# EAGLE design NUCLEO_UNIVERSAL_BOARD (EAGLE 9.6.2)
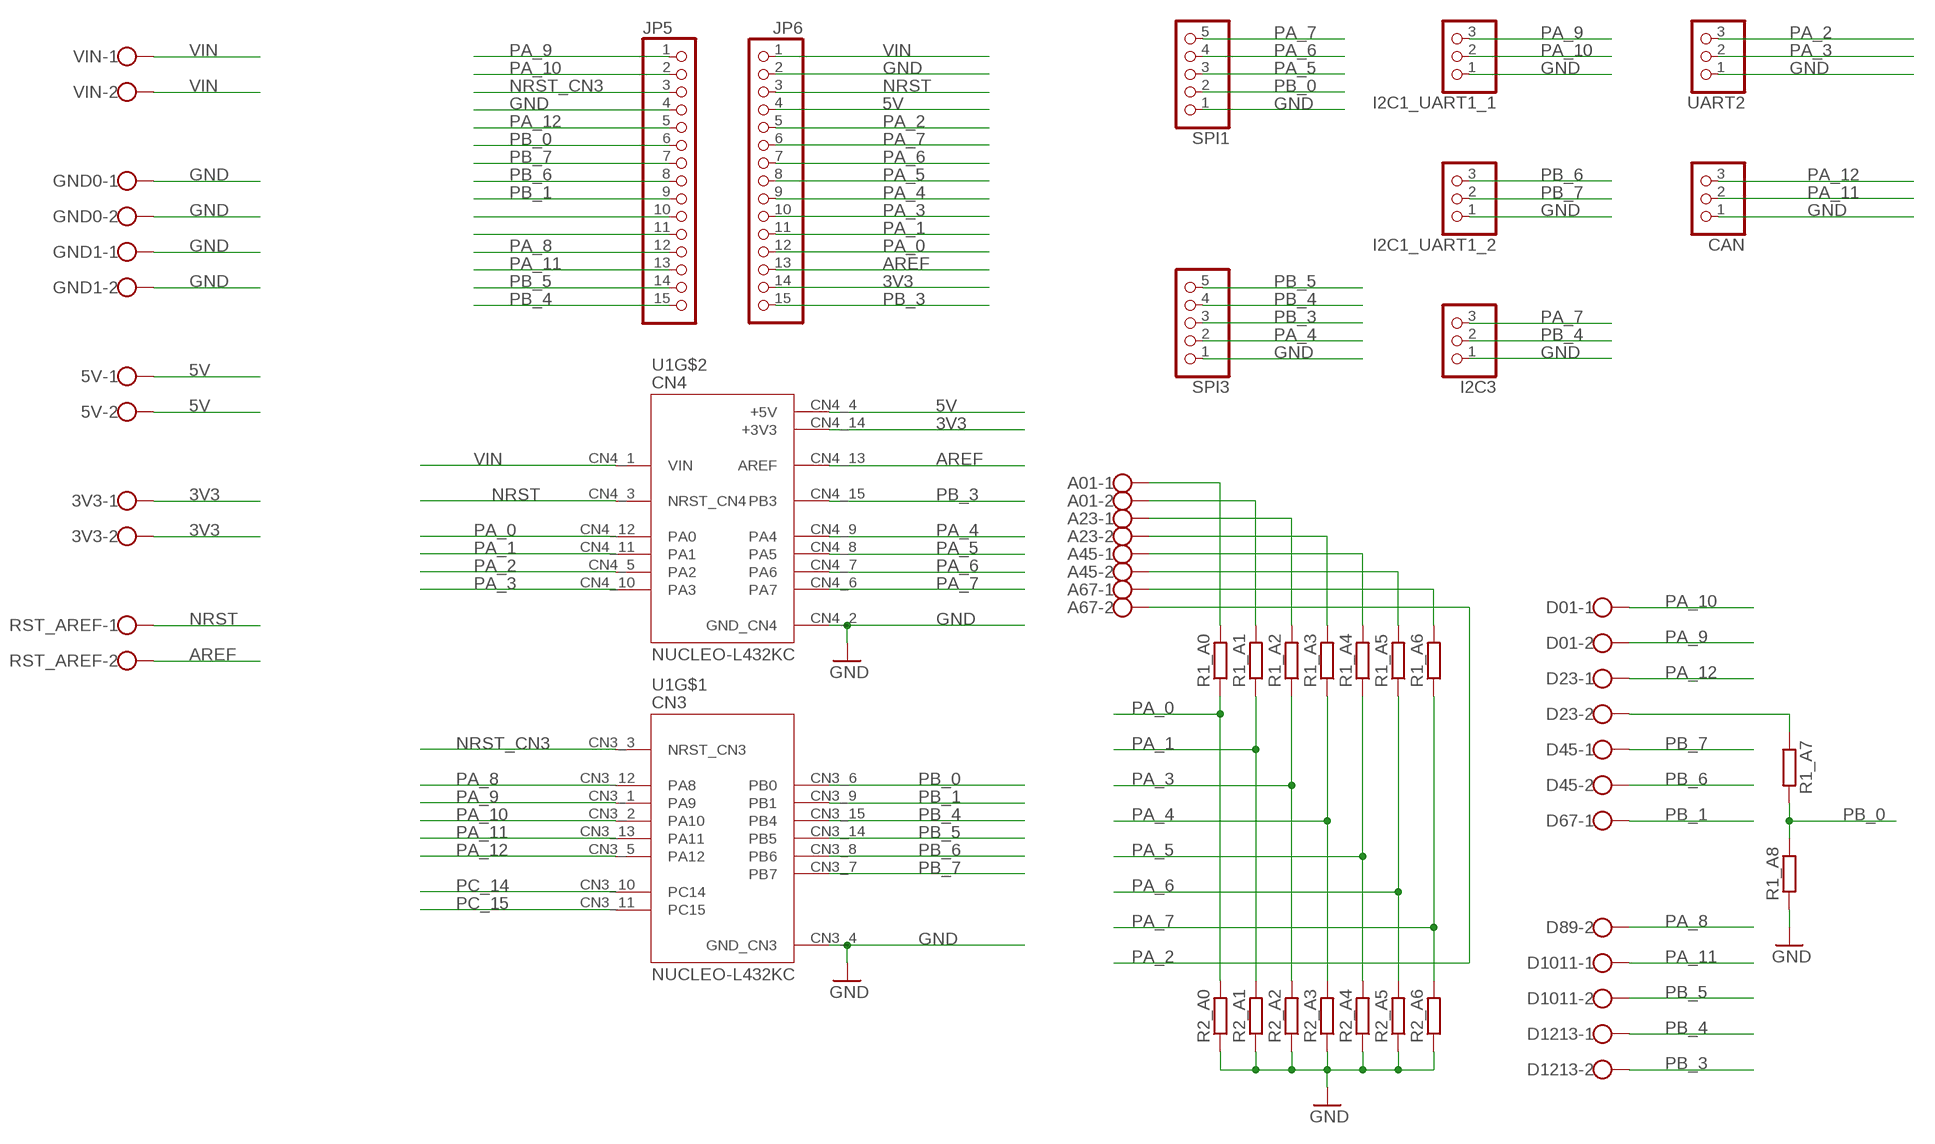
[diagram p0: schematic, sheet 1]

## Parts
3V3  W237-102  [W237-102]
5V  W237-102  [W237-102]
A01  W237-102  [W237-102]
A23  W237-102  [W237-102]
A45  W237-102  [W237-102]
A67  W237-102  [W237-102]
CAN  PINHD-1X3  [1X03]
D01  W237-102  [W237-102]
D23  W237-102  [W237-102]
D45  W237-102  [W237-102]
D67  W237-102  [W237-102]
D89  W237-102  [W237-102]
D1011  W237-102  [W237-102]
D1213  W237-102  [W237-102]
GND0  W237-102  [W237-102]
GND1  W237-102  [W237-102]
I2C1_UART1_1  PINHD-1X3  [1X03]
I2C1_UART1_2  PINHD-1X3  [1X03]
I2C3  PINHD-1X3  [1X03]
JP5  PINHD-1X15  [1X15]
JP6  PINHD-1X15  [1X15]
R1_A0  R-EU_M1206  [M1206]
R1_A1  R-EU_M1206  [M1206]
R1_A2  R-EU_M1206  [M1206]
R1_A3  R-EU_M1206  [M1206]
R1_A4  R-EU_M1206  [M1206]
R1_A5  R-EU_M1206  [M1206]
R1_A6  R-EU_M1206  [M1206]
R1_A7  R-EU_M1206  [M1206]
R1_A8  R-EU_M1206  [M1206]
R2_A0  R-EU_M1206  [M1206]
R2_A1  R-EU_M1206  [M1206]
R2_A2  R-EU_M1206  [M1206]
R2_A3  R-EU_M1206  [M1206]
R2_A4  R-EU_M1206  [M1206]
R2_A5  R-EU_M1206  [M1206]
R2_A6  R-EU_M1206  [M1206]
RST_AREF  W237-102  [W237-102]
SPI1  PINHD-1X5  [1X05]
SPI3  PINHD-1X5  [1X05]
U1  NUCLEO-L432KC  [MODULE_NUCLEO-L432KC]
UART2  PINHD-1X3  [1X03]
VIN  W237-102  [W237-102]

## Nets
3V3: 3V3.1 3V3.2 JP6.14 U1.CN4_14(+3V3)
5V: 5V.1 5V.2 JP6.4 U1.CN4_4(+5V)
AREF: JP6.13 RST_AREF.2 U1.CN4_13(AREF)
GND: CAN.1 GND0.1 GND0.2 GND1.1 GND1.2 I2C1_UART1_1.1 I2C1_UART1_2.1 I2C3.1 JP5.4 JP6.2 R1_A8.1 R2_A0.1 R2_A1.1 R2_A2.1 R2_A3.1 R2_A4.1 R2_A5.1 R2_A6.1 SPI1.1 SPI3.1 U1.CN3_4(GND_CN3) U1.CN4_2(GND_CN4) UART2.1
N$1: D23.2 R1_A7.1
N$11: A67.1 R1_A6.2
N$12: A45.2 R1_A5.2
N$29: JP5.10
N$30: JP5.11
N$31: A45.1 R1_A4.2
N$32: A23.2 R1_A3.2
N$33: A23.1 R1_A2.2
N$34: A01.2 R1_A1.2
N$35: A01.1 R1_A0.2
NRST: JP6.3 RST_AREF.1 U1.CN4_3(NRST_CN4)
NRST_CN3: JP5.3 U1.CN3_3(NRST_CN3)
PA_0: JP6.12 R1_A0.1 R2_A0.2 U1.CN4_12(PA0)
PA_1: JP6.11 R1_A1.1 R2_A1.2 U1.CN4_11(PA1)
PA_2: A67.2 JP6.5 U1.CN4_5(PA2) UART2.3
PA_3: JP6.10 R1_A2.1 R2_A2.2 U1.CN4_10(PA3) UART2.2
PA_4: JP6.9 R1_A3.1 R2_A3.2 SPI3.2 U1.CN4_9(PA4)
PA_5: JP6.8 R1_A4.1 R2_A4.2 SPI1.3 U1.CN4_8(PA5)
PA_6: JP6.7 R1_A5.1 R2_A5.2 SPI1.4 U1.CN4_7(PA6)
PA_7: I2C3.3 JP6.6 R1_A6.1 R2_A6.2 SPI1.5 U1.CN4_6(PA7)
PA_8: D89.2 JP5.12 U1.CN3_12(PA8)
PA_9: D01.2 I2C1_UART1_1.3 JP5.1 U1.CN3_1(PA9)
PA_10: D01.1 I2C1_UART1_1.2 JP5.2 U1.CN3_2(PA10)
PA_11: CAN.2 D1011.1 JP5.13 U1.CN3_13(PA11)
PA_12: CAN.3 D23.1 JP5.5 U1.CN3_5(PA12)
PB_0: JP5.6 R1_A7.2 R1_A8.2 SPI1.2 U1.CN3_6(PB0)
PB_1: D67.1 JP5.9 U1.CN3_9(PB1)
PB_3: D1213.2 JP6.15 SPI3.3 U1.CN4_15(PB3)
PB_4: D1213.1 I2C3.2 JP5.15 SPI3.4 U1.CN3_15(PB4)
PB_5: D1011.2 JP5.14 SPI3.5 U1.CN3_14(PB5)
PB_6: D45.2 I2C1_UART1_2.3 JP5.8 U1.CN3_8(PB6)
PB_7: D45.1 I2C1_UART1_2.2 JP5.7 U1.CN3_7(PB7)
PC_14: U1.CN3_10(PC14)
PC_15: U1.CN3_11(PC15)
VIN: JP6.1 U1.CN4_1(VIN) VIN.1 VIN.2
Unconnected: D67.2 D89.1

## Library data of the parts
3V3 5V A01 A23 A45 A67 D01 D23 D45 D67 D89 D1011 D1213 GND0 GND1 RST_AREF VIN = con-wago-500:W237-102: WAGO SCREW CLAMP; MPN: 237-102; OC_FARNELL: unknown; OC_NEWARK: 70K9898
CAN I2C1_UART1_1 I2C1_UART1_2 I2C3 UART2 = pinhead:PINHD-1X3: PIN HEADER
JP5 JP6 = pinhead:PINHD-1X15: PIN HEADER
R1_A0 R1_A1-R1_A8 R2_A0 R2_A1-R2_A6 = rcl:R-EU_: RESISTOR, European symbol; SPICEPREFIX: R
SPI1 SPI3 = pinhead:PINHD-1X5: PIN HEADER
U1 = NUCLEO-L432KC:NUCLEO-L432KC: STM32 Nucleo-32 development board with STM32L432KC MCU, supports Arduino connectivity Check prices <https://pricing.snapeda.com/parts/NUCLEO-L432KC/STMicroelectronics/view-part?ref=eda>; AVAILABILITY: Warning; DESCRIPTION: STM32L432KC, mbed-Enabled Development Nucleo-32 STM32L4 ARM® Cortex®-M4 MCU 32-Bit Embedded Evaluation Board; MF: STMicroelectronics; MP: NUCLEO-L432KC; PACKAGE: None; PRICE: None; PURCHASE-URL: https://pricing.snapeda.com/search/part/NUCLEO-L432KC/?ref=eda

## Board
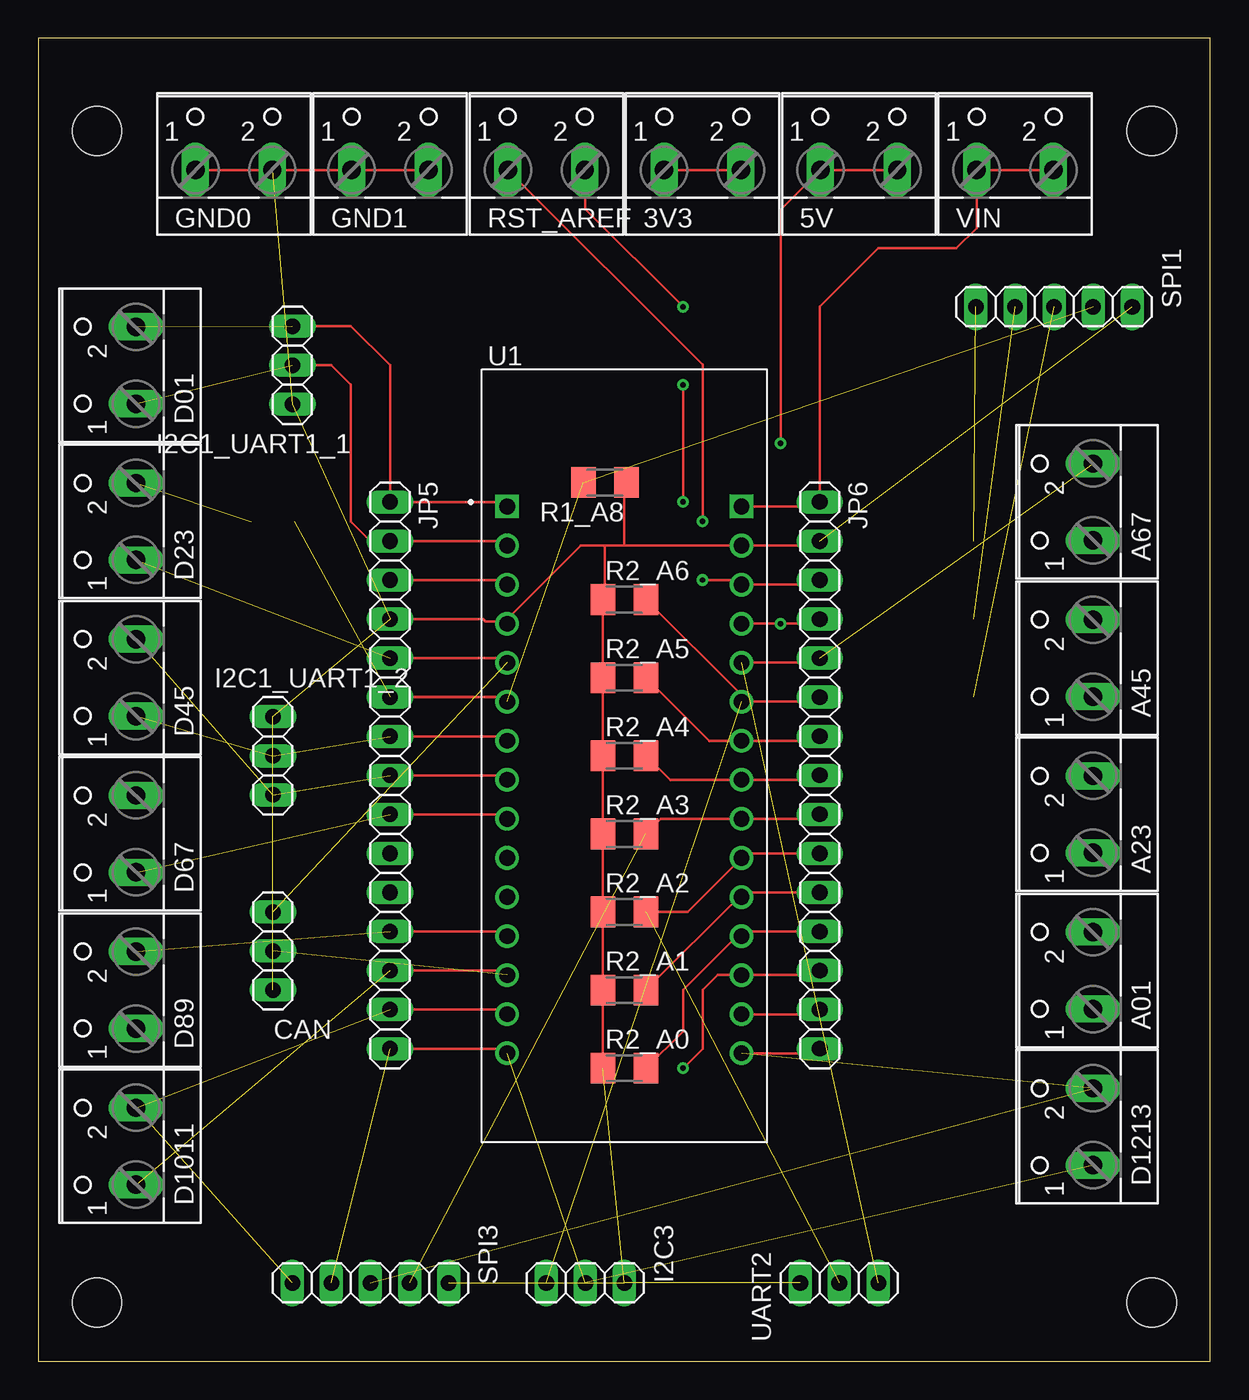
[diagram p1: board, top side]
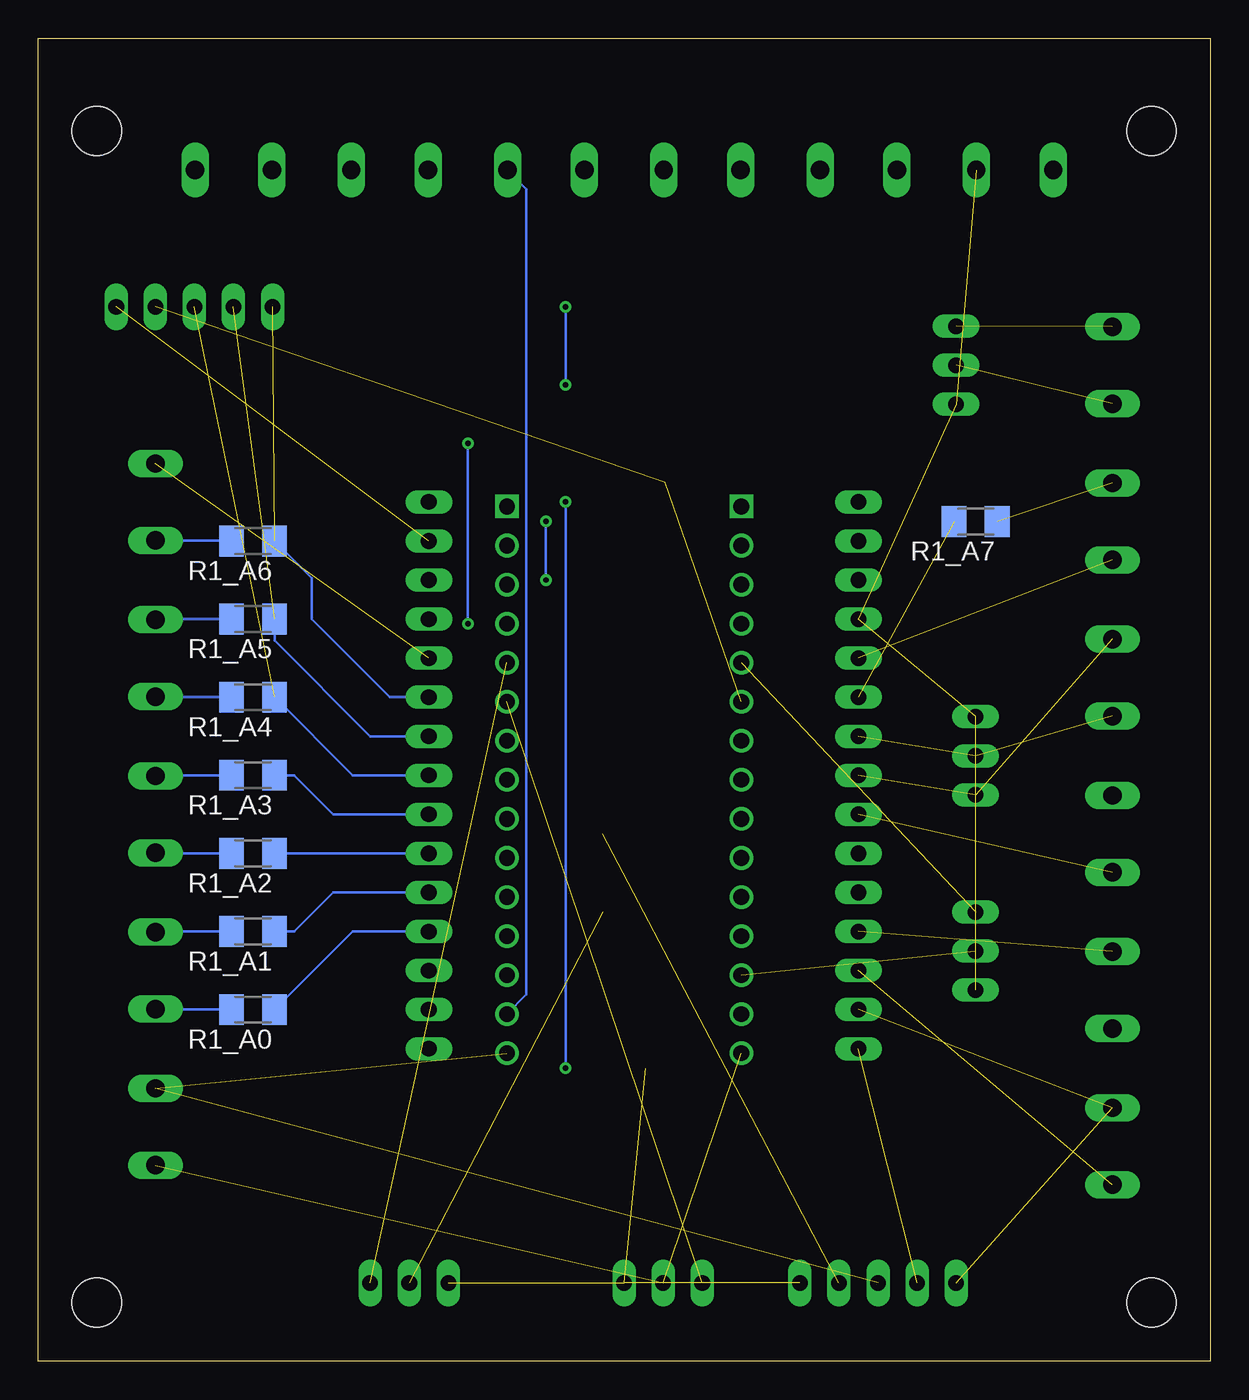
[diagram p2: board, bottom side, seen from below]

Size 76.18 x 86.03 mm. Coordinates in mm from the lower left corner, seen from the top.
Outline: 0,0 76.18,0 76.18,86.03 0,86.03 0,0
Copper layers (1*16): Top 0.035mm / dielectric 1.5mm / Bottom 0.035mm
Design rules "default": minimum track width 6mil, minimum drill 0.35mm, track to track 6mil, track to pad 6mil, pad to pad 6mil, via to via 6mil, smd to smd 6mil, copper to edge 40mil, drill to drill 6mil, minimum pad ring 10mil, minimum via ring 8mil, stop-mask expansion 4mil, vias tented up to drill 0mil, thermal gap 10mil
Holes 3.2 mm at 3.81,80.01 72.39,80.01 3.81,3.81 72.39,3.81

### Footprints (pad centres in the part's own frame; a part is rotated, then mirrored left to right if it is on the bottom)
W237-102 = drill 1.194 long: 1 -2.5,-1.27; 2 2.5,-1.27
1X03 = drill 1.016 long: 1 -2.54,0; 2 0,0; 3 2.54,0
1X15 = drill 1.016 long: 1 -17.78,0; 2 -15.24,0; 3 -12.7,0; 4 -10.16,0; 5 -7.62,0; 6 -5.08,0; 7 -2.54,0; 8 0,0; 9 2.54,0; 10 5.08,0; 11 7.62,0; 12 10.16,0; 13 12.7,0; 14 15.24,0; 15 17.78,0
M1206 = smd 1.6 x 2: 1 -1.4,0; 2 1.4,0
1X05 = drill 1.016 long: 1 -5.08,0; 2 -2.54,0; 3 0,0; 4 2.54,0; 5 5.08,0
MODULE_NUCLEO-L432KC = drill 1.02 square: CN3_1 -7.62,16.215; CN4_1 7.62,16.215 | drill 1.02: CN3_2 -7.62,13.675; CN3_3 -7.62,11.135; CN3_4 -7.62,8.595; CN3_5 -7.62,6.055; CN3_6 -7.62,3.515; CN3_7 -7.62,0.975; CN3_8 -7.62,-1.565; CN3_9 -7.62,-4.105; CN3_10 -7.62,-6.645; CN3_11 -7.62,-9.185; CN3_12 -7.62,-11.725; CN3_13 -7.62,-14.265; CN3_14 -7.62,-16.805; CN3_15 -7.62,-19.345; CN4_2 7.62,13.675; CN4_3 7.62,11.135; CN4_4 7.62,8.595; CN4_5 7.62,6.055; CN4_6 7.62,3.515; CN4_7 7.62,0.975; CN4_8 7.62,-1.565; CN4_9 7.62,-4.105; CN4_10 7.62,-6.645; CN4_11 7.62,-9.185; CN4_12 7.62,-11.725; CN4_13 7.62,-14.265; CN4_14 7.62,-16.805; CN4_15 7.62,-19.345

### Placement (x,y rotation side)
3V3  43.18,78.74 0 top
5V  53.34,78.74 0 top
A01  67.31,25.4 90 top
A23  67.31,35.56 90 top
A45  67.31,45.72 90 top
A67  67.31,55.88 90 top
CAN  15.24,26.67 90 top
D01  5.08,64.77 90 top
D23  5.08,54.61 90 top
D45  5.08,44.45 90 top
D67  5.08,34.29 90 top
D89  5.08,24.13 90 top
D1011  5.08,13.97 90 top
D1213  67.31,15.24 90 top
GND0  12.7,78.74 0 top
GND1  22.86,78.74 0 top
I2C1_UART1_1  16.51,64.77 90 top
I2C1_UART1_2  15.24,39.37 270 top
I2C3  35.56,5.08 180 top
JP5  22.86,38.1 270 top
JP6  50.8,38.1 270 top
R1_A0  62.23,22.86 180 bottom
R1_A1  62.23,27.94 180 bottom
R1_A2  62.23,33.02 180 bottom
R1_A3  62.23,38.1 180 bottom
R1_A4  62.23,43.18 180 bottom
R1_A5  62.23,48.26 180 bottom
R1_A6  62.23,53.34 180 bottom
R1_A7  15.24,54.61 180 bottom
R1_A8  36.83,57.15 180 top
R2_A0  38.1,19.05 0 top
R2_A1  38.1,24.13 0 top
R2_A2  38.1,29.21 0 top
R2_A3  38.1,34.29 0 top
R2_A4  38.1,39.37 0 top
R2_A5  38.1,44.45 0 top
R2_A6  38.1,49.53 0 top
RST_AREF  33.02,78.74 0 top
SPI1  66.04,68.58 180 top
SPI3  21.59,5.08 180 top
U1  38.1,39.37 0 top
UART2  52.07,5.08 0 top
VIN  63.5,78.74 0 top

### Tracks (layer width: path | path; a pad name or v marks a point on that pad's centre or on a via)
3V3
  Top 0.152: JP6.14 50.51,22.57 U1.CN4_14 | 3V3.1 3V3.2
  Bottom 0.152: U1.CN4_14 44.45,23.84 44.45,76.24 3V3.2
5V  (via drill 0.35)
  Top 0.152: JP6.4 50.51,47.97 v48.26,47.97 U1.CN4_4 | 5V.2 5V.1 48.26,74.89 v48.26,59.69
  Bottom 0.152: v48.26,59.69 v48.26,47.97
AREF  (via drill 0.35)
  Top 0.152: JP6.13 50.51,25.11 U1.CN4_13 44.16,25.11 43.18,24.13 43.18,20.32 v41.91,19.05 | RST_AREF.2 35.56,77.43 35.56,74.93 v41.91,68.58 | v41.91,63.5 v41.91,55.88
  Bottom 0.152: v41.91,68.58 v41.91,63.5 | v41.91,55.88 v41.91,19.05
GND  (8 unrouted)
  Top 0.152: JP5.4 28.91,48.26 29.06,48.11 30.33,48.11 | 30.33,48.11 U1.CN3_4 | JP6.2 50.51,53.05 U1.CN4_2 38.1,53.05 | 38.1,53.05 36.83,53.05 | 36.83,53.05 35.27,53.05 30.33,48.11 | GND0.1 GND0.2 GND1.1 GND1.2 | R2_A0.1 R2_A1.1 R2_A2.1 R2_A3.1 R2_A4.1 R2_A5.1 R2_A6.1 36.83,49.66 36.83,53.05 | R1_A8.1 38.1,57.02 38.1,53.05
N$1  (1 unrouted)
N$11
  Bottom 0.152: R1_A6.2 63.67,53.38 A67.1
N$12
  Bottom 0.152: R1_A5.2 68.54,48.26 A45.2
N$31
  Bottom 0.152: R1_A4.2 68.54,43.18 A45.1
N$32
  Bottom 0.152: R1_A3.2 68.54,38.1 A23.2
N$33
  Bottom 0.152: R1_A2.2 68.54,33.02 A23.1
N$34
  Bottom 0.152: R1_A1.2 68.54,27.94 A01.2
N$35
  Bottom 0.152: R1_A0.2 68.54,22.86 A01.1
NRST  (via drill 0.35)
  Top 0.152: JP6.3 50.51,50.51 U1.CN4_3 45.42,50.8 v43.18,50.8 | RST_AREF.1 43.18,64.81 v43.18,54.61
  Bottom 0.152: v43.18,54.61 v43.18,50.8
NRST_CN3
  Top 0.152: JP5.3 30.18,50.8 U1.CN3_3
PA_0
  Top 0.152: JP6.12 46.02,27.94 45.87,27.79 | 45.87,27.79 U1.CN4_12 | R2_A0.2 41.91,21.46 41.91,24.13 45.57,27.79 45.87,27.79
  Bottom 0.152: JP6.12 55.75,27.94 R1_A0.1
PA_1
  Top 0.152: JP6.11 46.02,30.48 45.87,30.33 | 45.87,30.33 U1.CN4_11 | R2_A1.2 45.7,30.33 45.87,30.33
  Bottom 0.152: R1_A1.1 59.56,27.94 57.02,30.48 JP6.11
PA_2  (2 unrouted)
  Top 0.152: JP6.5 50.51,45.42 U1.CN4_5
PA_3  (1 unrouted)
  Top 0.152: JP6.10 46.02,33.02 45.87,32.87 U1.CN4_10 42.2,29.21 R2_A2.2
  Bottom 0.152: R1_A2.1 JP6.10
PA_4  (1 unrouted)
  Top 0.152: JP6.9 50.51,35.27 U1.CN4_9 40.48,35.27 R2_A3.2
  Bottom 0.152: R1_A3.1 59.56,38.1 57.02,35.56 JP6.9
PA_5  (1 unrouted)
  Top 0.152: JP6.8 50.51,37.8 U1.CN4_8 41.06,37.8 R2_A4.2
  Bottom 0.152: R1_A4.1 55.75,38.1 JP6.8
PA_6  (1 unrouted)
  Top 0.152: JP6.7 50.51,40.34 U1.CN4_7 43.6,40.34 R2_A5.2
  Bottom 0.152: R1_A5.1 60.83,46.86 54.61,40.64 JP6.7
PA_7  (2 unrouted)
  Top 0.152: JP6.6 50.51,42.88 U1.CN4_6 45.72,43.31 R2_A6.2
  Bottom 0.152: R1_A6.1 58.42,50.93 58.42,48.26 53.34,43.18 JP6.6
PA_8  (1 unrouted)
  Top 0.152: JP5.12 30.18,27.94 U1.CN3_12
PA_9  (1 unrouted)
  Top 0.152: U1.CN3_1 30.18,55.88 JP5.1 22.86,64.77 20.32,67.31 I2C1_UART1_1.3
PA_10  (1 unrouted)
  Top 0.152: U1.CN3_2 30.18,53.34 JP5.2 21.59,53.34 20.32,54.61 20.32,63.5 19.05,64.77 I2C1_UART1_1.2
PA_11  (2 unrouted)
  Top 0.152: JP5.13 30.18,25.4 U1.CN3_13
PA_12  (2 unrouted)
  Top 0.152: JP5.5 30.18,45.72 U1.CN3_5
PB_0  (3 unrouted)
  Top 0.152: JP5.6 30.18,43.18 U1.CN3_6
PB_1  (1 unrouted)
  Top 0.152: JP5.9 30.18,35.56 U1.CN3_9
PB_3  (2 unrouted)
  Top 0.152: JP6.15 50.51,20.02 U1.CN4_15
PB_4  (3 unrouted)
  Top 0.152: JP5.15 30.18,20.32 U1.CN3_15
PB_5  (2 unrouted)
  Top 0.152: JP5.14 30.18,22.86 U1.CN3_14
PB_6  (2 unrouted)
  Top 0.152: JP5.8 30.18,38.1 U1.CN3_8
PB_7  (2 unrouted)
  Top 0.152: JP5.7 30.18,40.64 U1.CN3_7
VIN
  Top 0.152: U1.CN4_1 50.51,55.59 JP6.1 50.8,68.58 54.61,72.39 59.69,72.39 61,73.7 VIN.1 VIN.2